# EasyEDA Pro project ProProject_NAFA AstrAlim_2024-01-08.epro, board AstrAlim PCB
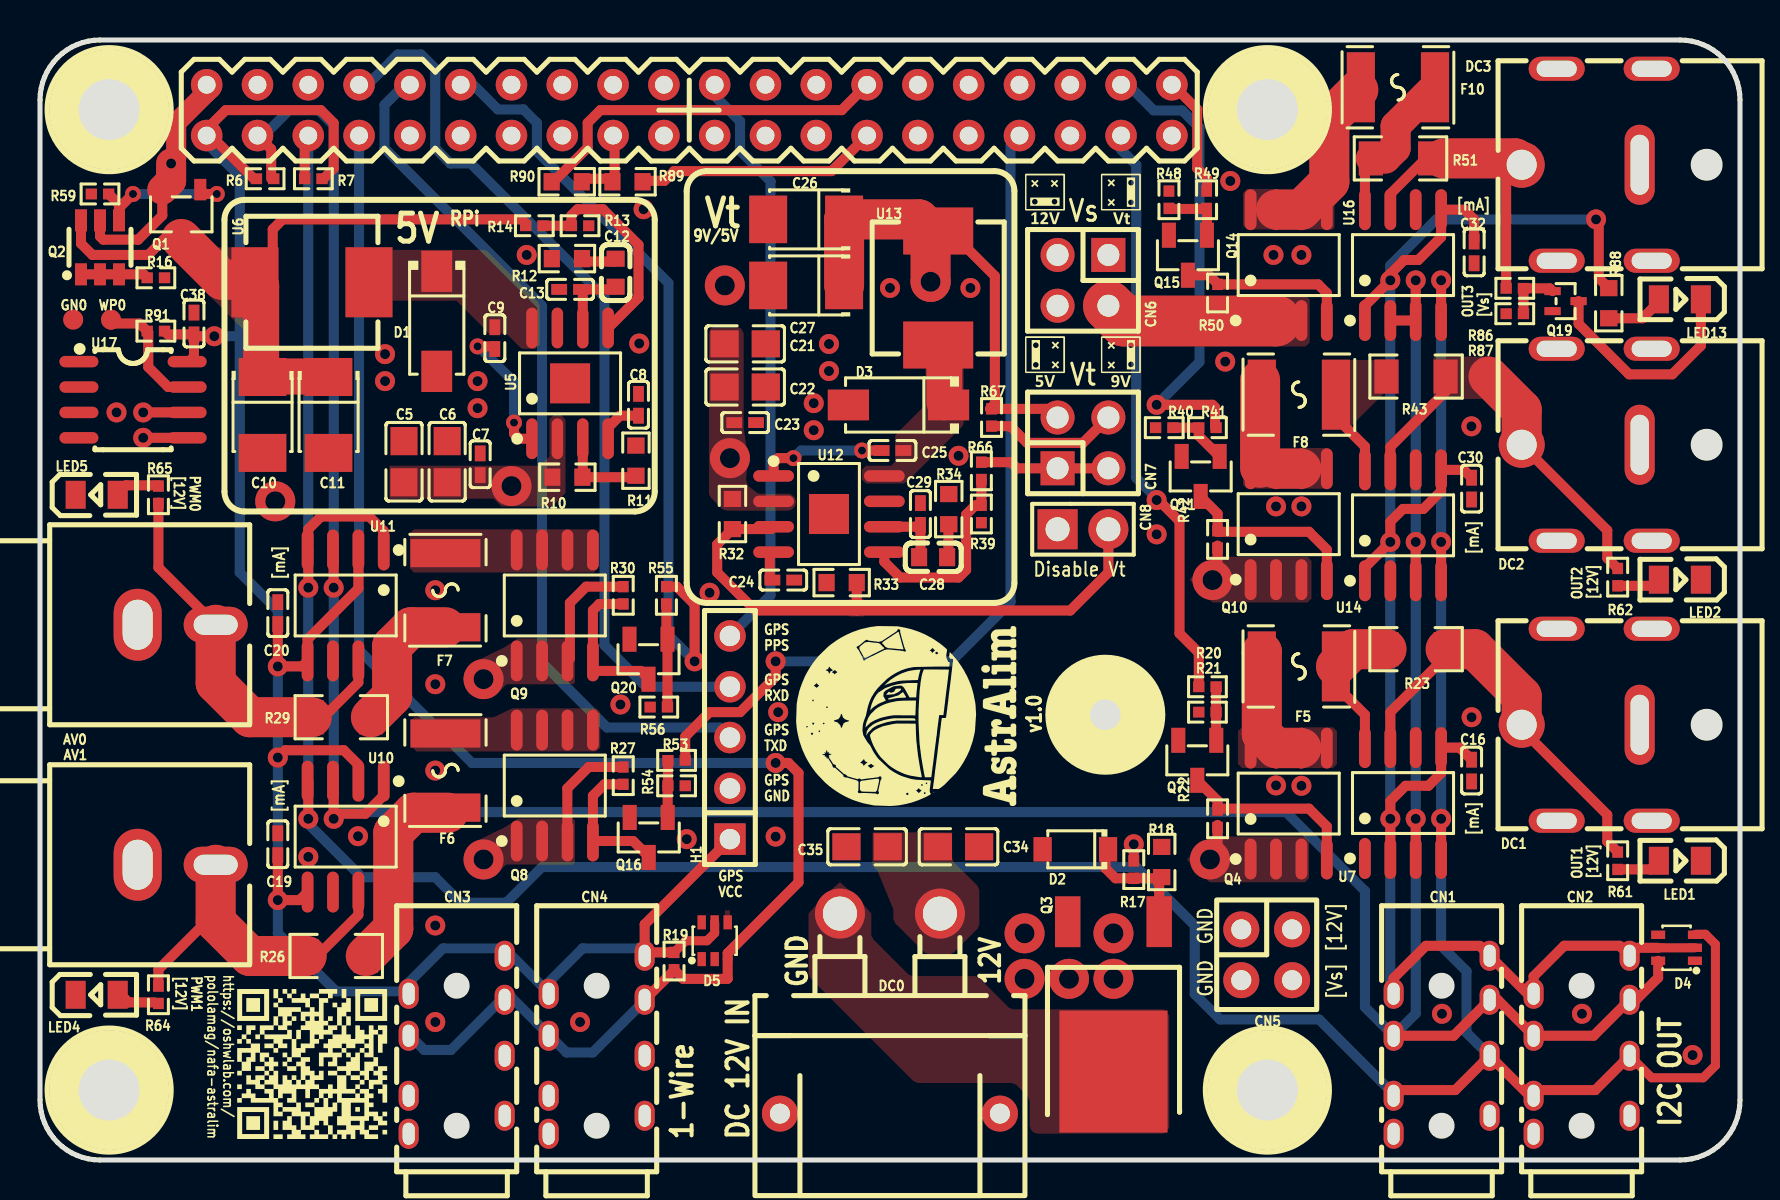
[diagram p2: board, top side]
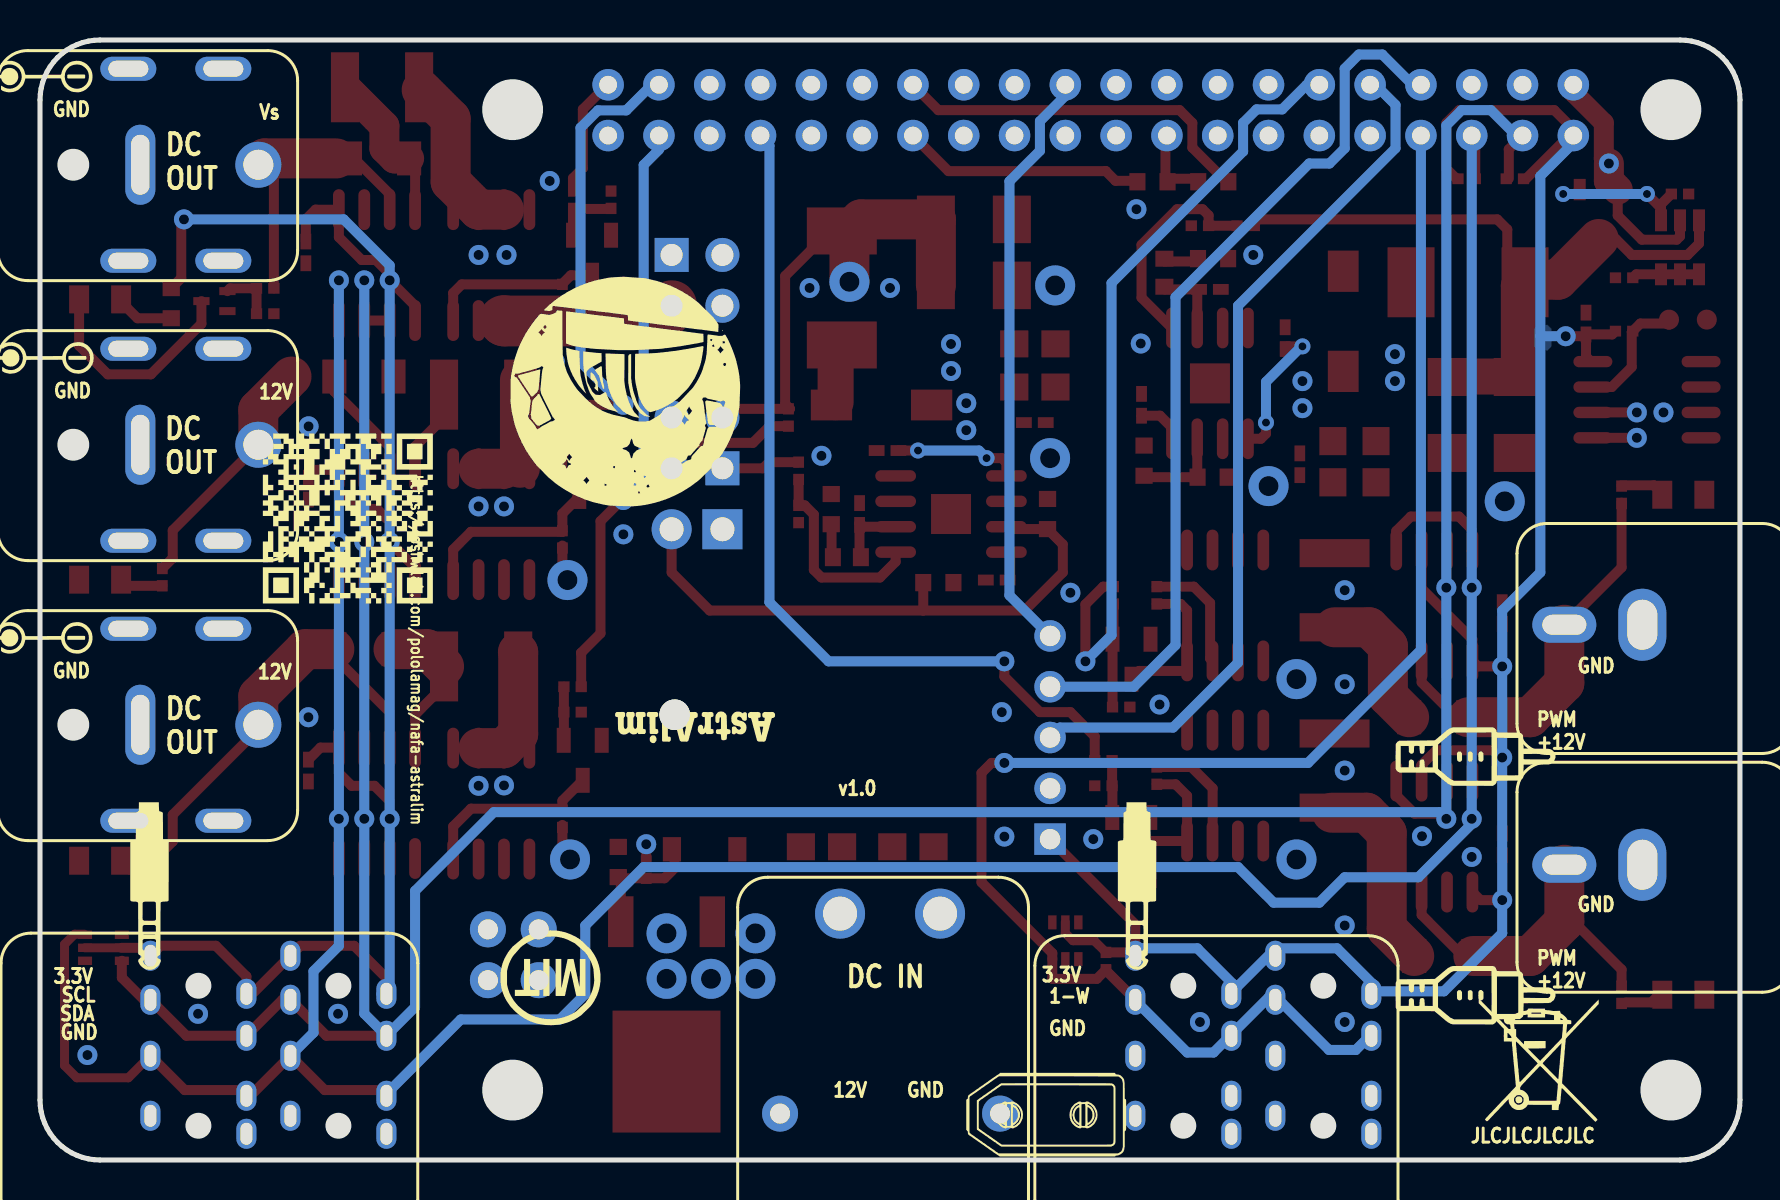
[diagram p3: board, bottom side, seen from below]

Outline 85 x 56 mm; copper layers: Top Layer, Inner1, Inner2, Bottom Layer. Coordinates in mm from the lower left corner of the outline.
Stack: Top Layer 0.035mm 外层铜厚1oz / Dielectric1 0.2104mm 7628 RC49% 8.6mil / Inner1 0.0152mm 内层铜厚 / Dielectric2 1.065mm 1.1mm H/HOZ 含铜 / Inner2 0.0152mm 内层铜厚 / Dielectric3 0.2104mm 7628 RC49% 8.6mil / Bottom Layer 0.035mm 外层铜厚1oz

## Design rules (mm)
template: Custom Config
spacing copperThickness1oz (default): track to track 0.102, other pairs 0.152 to 0.3
spacing copperThickness2oz: track to track 0.203, other pairs 0.152 to 0.3
spacing safeClearance1: track to track 0.152, other pairs 0.152 to 0.3
track width copperThickness1oz (default): min 0.3, default 0.5, max 6
track width copperThickness2oz: min 0.203, default 0.254, max 2.54
differential pair differentialPair (default): width min 0.127, default 0.254, max 2.54; gap min 0.152, default 0.152
via viaSize (default): diameter min 0.5, default 0.61, max 10; hole min 0.3, default 0.305, max 6.299

## Placement (name value [footprint] x y rotation side)
AV0  AV-5  [CONN-TH_AV-5]  6.83 26.76 270 top
AV1  AV-5  [CONN-TH_AV-5]  6.83 14.76 270 top
C5  4.7uF  [C0805]  18.2 34.91 270 top
C6  4.7uF  [C0805]  20.36 34.91 270 top
C7  10nF  [C0402]  22.01 34.79 270 top
C8  10nF  [C0402]  29.92 37.76 270 top
C9  10nF  [C0402]  22.74 41.09 90 top
C10  47uF  [CAP-SMD_L3.5-W2.8-R-RD]  11.13 37.25 90 top
C11  47uF  [CAP-SMD_L3.5-W2.8-R-RD]  14.43 37.25 90 top
C12  2.2nF  [C0603]  28.78 44.36 270 top
C13  22pF  [C0402]  26.5 43.53 0 top
C16  100nF  [C0402]  71.58 19.47 270 top
C19  100nF  [C0402]  11.89 15.79 90 top
C20  100nF  [C0402]  11.89 27.35 90 top
C21  4.7uF  [C0805]  35.26 40.81 180 top
C22  4.7uF  [C0805]  35.26 38.65 180 top
C23  10nF  [C0402]  35.26 36.87 180 top
C24  10nF  [C0402]  37.16 29 180 top
C25  10nF  [C0402]  42.62 35.47 0 top
C26  47uF  [CAP-SMD_L3.5-W2.8-R-RD]  38.31 47.03 0 top
C27  47uF  [CAP-SMD_L3.5-W2.8-R-RD]  38.31 43.73 0 top
C28  2.2nF  [C0603]  44.66 30.14 180 top
C29  22pF  [C0402]  44.02 32.3 270 top
C30  100nF  [C0402]  71.58 33.57 270 top
C32  100nF  [C0402]  71.71 45.38 270 top
C34  22uF  [C0805]  45.93 15.66 180 top
C35  22uF  [C0805]  41.35 15.66 0 top
C38  100nF  [C0402]  7.7 41.82 270 top
CN1  PJ-35372  [AUDIO-TH_PJ-35372]  70.08 5.76 180 top
CN2  PJ-35372  [AUDIO-TH_PJ-35372]  77.08 5.76 180 top
CN3  PJ-35372  [AUDIO-TH_PJ-35372]  20.83 5.76 180 top
CN4  PJ-35372  [AUDIO-TH_PJ-35372]  27.83 5.76 180 top
CN5  2.54-2*2  [HDR-TH_4P-P2.54-V-F-R2-C2-S2.54]  61.33 10.26 270 top
CN6  PH-00068  [HDR-TH_4P-P2.54-V-M-R2-C2-S2.54]  52.15 43.98 180 top
CN7  PH-00068  [HDR-TH_4P-P2.54-V-M-R2-C2-S2.54]  52.15 35.86 0 top
CN8  PZ254V-11-02P  [HDR-TH_2P-P2.54-V-M]  52.15 31.54 0 top
D1  SS54  [SMA_L4.4-W2.8-LS5.4-R-RD]  19.84 41.94 270 top
D2  MM1Z15  [SOD-123_L2.7-W1.6-LS3.7-RD]  51.77 15.53 180 top
D3  SS54  [SMA_L4.4-W2.8-LS5.4-R-RD]  42.92 37.75 180 top
D4  BAV99S,115  [SOT-363_L2.0-W1.3-P0.65-LS2.1-TL]  81.83 10.61 180 top
D5  BAV99S,115  [SOT-363_L2.0-W1.3-P0.65-LS2.1-TL]  33.73 10.96 90 top
DC0  XT30PW-M  [CONN-TH_XT30PW-F-1]  42.5 9.82 0 top
DC1  DC-053D-25A  [DC-IN-TH_DC-053D-25A-1]  77.33 21.76 270 top
DC2  DC-053D-25A  [DC-IN-TH_DC-053D-25A-1]  77.33 35.76 270 top
DC3  DC-053D-25A  [DC-IN-TH_DC-053D-25A-1]  77.33 49.76 270 top
F5  SMD1812P300SLR/24  [F1812]  62.94 24.68 180 top
F6  SMD1812P300SLR/24  [F1812]  20.27 19.47 90 top
F7  SMD1812P300SLR/24  [F1812]  20.27 28.49 90 top
F8  SMD1812P300SLR/24  [F1812]  62.94 38.27 180 top
F10  SMD1812P300SLR/24  [F1812]  67.9 53.64 180 top
GN0  -  [test-point-0.5mm]  1.66 42.02 180 top
H1  2.54-1*5P  [HDR-TH_5P-P2.54-V-F]  34.5 21.12 90 top
LED1  NCD0805R1  [LED0805-R-RD]  81.99 14.96 180 top
LED2  NCD0805R1  [LED0805-R-RD]  81.99 29.02 180 top
LED4  NCD0805R1  [LED0805-R-RD]  2.83 8.26 0 top
LED5  NCD0805R1  [LED0805-R-RD]  2.83 33.26 0 top
LED13  NCD0805R1  [LED0805-R-RD]  81.99 43.03 180 top
NOREF  -  [Pad_e599]  53.27 22.26 180 top
Q1  DMMT5401-7-F  [SOT-23-6_L2.9-W1.6-P0.95-LS2.8-BR]  3 45.63 270 top
Q2  AP2317A  [SOT-23-3_L2.9-W1.6-P1.90-LS2.8-BR]  7.06 47.28 90 top
Q3  IRFR1205TRPBF  [TO-252-3_L6.5-W5.8-P4.58-BL]  53.67 8.17 180 top
Q4  NCE30P12S  [SOIC-8_L4.9-W3.9-P1.27-LS6.0-BL]  62.44 17.82 0 top
Q7  MMBT3904  [SOT-23-3_L2.9-W1.3-P1.90-LS2.4-BR]  57.87 19.98 90 top
Q8  NCE30P12S  [SOIC-8_L4.9-W3.9-P1.27-LS6.0-BL]  25.74 18.72 0 top
Q9  NCE30P12S  [SOIC-8_L4.9-W3.9-P1.27-LS6.0-BL]  25.74 27.73 0 top
Q10  NCE30P12S  [SOIC-8_L4.9-W3.9-P1.27-LS6.0-BL]  62.44 31.79 0 top
Q11  MMBT3904  [SOT-23-3_L2.9-W1.3-P1.90-LS2.4-BR]  58.03 34.18 90 top
Q14  NCE30P12S  [SOIC-8_L4.9-W3.9-P1.27-LS6.0-BL]  62.44 44.75 0 top
Q15  MMBT3904  [SOT-23-3_L2.9-W1.3-P1.90-LS2.4-BR]  57.4 45.24 90 top
Q16  MMBT3904  [SOT-23-3_L2.9-W1.3-P1.90-LS2.4-BR]  30.44 16.13 90 top
Q19  MMBT3904TT1G  [SC-75-3_L1.6-W0.8-P1.00-LS1.6-BR]  76.28 42.94 180 top
Q20  MMBT3904  [SOT-23-3_L2.9-W1.3-P1.90-LS2.4-BR]  30.43 25.04 90 top
R6  10kΩ  [R0402]  11.26 49.06 180 top
R7  10kΩ  [R0402]  13.67 49.06 0 top
R10  665kΩ  [R0603]  26.37 34.14 180 top
R11  130kΩ  [R0603]  29.8 34.97 270 top
R12  39kΩ  [R0603]  26.35 45.07 180 top
R13  1.96kΩ  [R0402]  27 46.71 180 top
R14  10.2kΩ  [R0402]  24.72 46.71 180 top
R16  10kΩ  [R0402]  5.79 44.11 180 top
R17  1kΩ  [R0402]  54.69 14.52 270 top
R18  470kΩ  [R0603]  56.09 14.9 270 top
R19  4.7kΩ  [R0402]  31.7 9.95 90 top
R20  10kΩ  [R0402]  58.37 22.39 0 top
R21  1kΩ  [R0402]  58.37 23.66 0 top
R22  1kΩ  [R0402]  58.88 17.06 270 top
R23  10mΩ  [R1206]  68.8 25.54 180 top
R26  10mΩ  [R1206]  14.81 10.2 0 top
R27  1kΩ  [R0402]  29.16 19.22 90 top
R29  10mΩ  [R1206]  15.06 22.14 0 top
R30  1kΩ  [R0402]  29.16 28.23 90 top
R32  665kΩ  [R0603]  34.62 32.3 90 top
R33  82kΩ  [R0603]  40.08 28.87 0 top
R34  39kΩ  [R0603]  45.44 32.54 90 top
R39  1.96kΩ  [R0402]  47.07 32.3 90 top
R40  10kΩ  [R0402]  56.21 36.62 0 top
R41  1kΩ  [R0402]  58.37 36.62 180 top
R42  1kΩ  [R0402]  58.88 31.03 270 top
R43  10mΩ  [R1206]  68.8 39.17 180 top
R48  10kΩ  [R0402]  56.45 48.01 270 top
R49  1kΩ  [R0402]  58.33 48.01 270 top
R50  1kΩ  [R0402]  58.88 43.35 270 top
R51  10mΩ  [R1206]  68.02 50.08 180 top
R53  1kΩ  [R0402]  31.83 19.98 180 top
R54  10kΩ  [R0402]  31.83 18.71 180 top
R55  1kΩ  [R0402]  31.32 28.23 270 top
R56  10kΩ  [R0402]  30.94 22.65 0 top
R59  47kΩ  [R0402]  3 48.3 0 top
R61  470Ω  [R0402]  78.88 14.96 270 top
R62  470Ω  [R0402]  78.88 29.14 270 top
R64  470Ω  [R0402]  5.92 8.26 270 top
R65  470Ω  [R0402]  5.92 33.26 90 top
R66  10.2kΩ  [R0402]  47.07 34.46 90 top
R67  10kΩ  [R0402]  47.58 37.12 90 top
R86  10kΩ  [R0402]  73.74 43.58 180 top
R87  10kΩ  [R0402]  73.74 42.31 0 top
R88  68Ω  [R0603]  78.44 42.84 270 top
R89  3.9kΩ  [R0603]  29.38 48.91 180 top
R90  3.9kΩ  [R0603]  26.34 48.91 0 top
R91  1kΩ  [R0402]  5.79 41.44 0 top
U0  RASPI HAT FULL  [RASBERRYPI-3-HAT-EXT]  8.33 53.76 0 top
U5  TPS54531DDAR  [SOIC-8_L5.0-W4.0-P1.27-LS6.0-BL-EP2.0]  26.5 38.83 0 top
U6  4.7uH  [IND-SMD_L7.2-W6.6_GPSR07X0]  13.6 43.89 180 top
U7  INA219AIDR  [SOIC-8_L4.9-W3.9-P1.27-LS6.0-BL]  68.15 17.85 0 top
U10  INA219AIDR  [SOIC-8_L4.9-W3.9-P1.27-LS6.0-BL]  15.28 16.17 180 top
U11  INA219AIDR  [SOIC-8_L4.9-W3.9-P1.27-LS6.0-BL]  15.28 27.73 180 top
U12  TPS54531DDAR  [SOIC-8_L5.0-W4.0-P1.27-LS6.0-BL-EP2.0]  39.45 32.3 270 top
U13  4.7uH  [IND-SMD_L7.2-W6.6_GPSR07X0]  44.91 43.6 90 top
U14  INA219AIDR  [SOIC-8_L4.9-W3.9-P1.27-LS6.0-BL]  68.15 31.73 0 top
U16  INA219AIDR  [SOIC-8_L4.9-W3.9-P1.27-LS6.0-BL]  68.15 44.75 0 top
U17  CAT24C32WI-GT3  [SOIC-8_L5.0-W4.0-P1.27-LS6.0-BL]  4.65 38.01 270 top
WP0  -  [test-point-0.5mm]  3.55 42.02 180 top

## Footprints (pads in the part's own frame, mm; a bottom-side part is the same pattern mirrored in y, then rotated)
AUDIO-TH_PJ-35372
  oval 1x1.5 hole 0.6x1.1: 1(-2.4,3.55) 2(-2.4,0.55) 3(-2.4,-2.25) 4(-2.4,-4.45) 5(2.4,4.45) 6(2.4,2.55) 7(2.4,-0.45) 8(2.4,-2.55)
C0402
  rect 0.79x0.54 smd: 1(-0.545,0) 2(0.545,0)
C0603
  rect 0.8x0.9 smd: 1(-0.7,0) 2(0.7,0)
C0805
  rect 1.41x1.35 smd: 1(-1.03,0) 2(1.03,0)
CAP-SMD_L3.5-W2.8-R-RD
  rect 1.9x2.376 smd: 1(1.899,0) 2(-1.899,0)
CONN-TH_AV-5
  oval 3.6x2.4 hole 2.5x1.5: 1(0,-1.95)
  oval 1.8x3.2 hole 1x2.2: 2(0,1.95)
CONN-TH_XT30PW-F-1
  round 2.5 hole 1.7: 1(-2.5,2.5) 2(2.5,2.5)
  round 1.8 hole 1: 3(5.5,-7.5) 4(-5.5,-7.5)
DC-IN-TH_DC-053D-25A-1
  round 2.3 hole 1.5: 1(0,-3.25)
  oval 4x1.5 hole 3x0.914: 2(0,2.65)
  oval 1.2x2.8 hole 0.8x2: 3(-4.8,3.25) 3(-4.8,-1.5) 3(4.8,3.25) 3(4.8,-1.5)
F1812
  rect 1.407x3.499 smd: 1(-1.853,0) 2(1.853,0)
HDR-TH_2P-P2.54-V-M
  rect 2x2 hole 1.2: 1(-1.27,0)
  round 2 hole 1.2: 2(1.27,0)
HDR-TH_4P-P2.54-V-F-R2-C2-S2.54
  round 1.8 hole 1: 1(-1.27,-1.27) 2(-1.27,1.27) 3(1.27,-1.27) 4(1.27,1.27)
HDR-TH_4P-P2.54-V-M-R2-C2-S2.54
  rect 1.7x1.7 hole 1.1: 1(-1.27,-1.27)
  round 1.7 hole 1.1: 2(-1.27,1.27) 3(1.27,-1.27) 4(1.27,1.27)
HDR-TH_5P-P2.54-V-F
  rect 1.575x1.575 hole 1.02: 1(-5.08,0)
  round 1.575 hole 1.02: 2(-2.54,0) 3(0,0) 4(2.54,0) 5(5.08,0)
IND-SMD_L7.2-W6.6_GPSR07X0
  rect 2.35x3.5 smd: 1(-2.85,0) 2(2.85,0)
LED0805-R-RD
  rect 1x1.399 smd: 1(1.05,0) 2(-1.05,0)
Pad_e599
  round 1.524 hole 3: 41(0,0)
R0402
  rect 0.566x0.54 smd: 1(-0.433,0) 2(0.433,0)
R0603
  rect 0.806x0.864 smd: 1(-0.753,0) 2(0.753,0)
R1206
  rect 1.208x1.701 smd: 1(-1.479,0) 2(1.479,0)
RASBERRYPI-3-HAT-EXT
  round 1.575 hole 0.889: 1(0,-2.54) 2(0,0) 3(2.54,-2.54) 4(2.54,0) 5(5.08,-2.54) 6(5.08,0) 7(7.62,-2.54) 8(7.62,0) 9(10.16,-2.54) 10(10.16,0) 11(12.7,-2.54) 12(12.7,0) 13(15.24,-2.54) 14(15.24,0) 15(17.78,-2.54) 16(17.78,0) 17(20.32,-2.54) 18(20.32,0) 19(22.86,-2.54) 20(22.86,0) 21(25.4,-2.54) 22(25.4,0) 23(27.94,-2.54) 24(27.94,0) 25(30.48,-2.54) 26(30.48,0) 27(33.02,-2.54) 28(33.02,0) 29(35.56,-2.54) 30(35.56,0) 31(38.1,-2.54) 32(38.1,0) 33(40.64,-2.54) 34(40.64,0) 35(43.18,-2.54) 36(43.18,0) 37(45.72,-2.54) 38(45.72,0) 39(48.26,-2.54) 40(48.26,0)
SC-75-3_L1.6-W0.8-P1.00-LS1.6-BR
  rect 0.816x0.4 smd: 1(0.65,-0.5) 2(0.65,0.5) 3(-0.65,0)
SMA_L4.4-W2.8-LS5.4-R-RD
  rect 2.062x1.539 smd: 1(2.503,0) 2(-2.503,0)
SOD-123_L2.7-W1.6-LS3.7-RD
  rect 0.91x1.22 smd: 1(-1.635,0) 2(1.635,0)
SOIC-8_L4.9-W3.9-P1.27-LS6.0-BL
  oval 0.588x2.045 smd: 1(-1.905,-2.772) 2(-0.635,-2.772) 3(0.635,-2.772) 4(1.905,-2.772) 5(1.905,2.772) 6(0.635,2.772) 7(-0.635,2.772) 8(-1.905,2.772)
SOIC-8_L5.0-W4.0-P1.27-LS6.0-BL
  oval 0.569x1.95 smd: 1(-1.905,-2.705) 2(-0.635,-2.705) 3(0.635,-2.705) 4(1.905,-2.705) 5(1.905,2.705) 6(0.635,2.705) 7(-0.635,2.705) 8(-1.905,2.705)
SOIC-8_L5.0-W4.0-P1.27-LS6.0-BL-EP2.0
  oval 0.574x2.038 smd: 1(-1.905,-2.769) 2(-0.635,-2.769) 3(0.635,-2.769) 4(1.905,-2.769) 5(1.905,2.769) 6(0.635,2.769) 7(-0.635,2.769) 8(-1.905,2.769)
  rect 2x2 smd: 9(0,0)
SOT-23-3_L2.9-W1.3-P1.90-LS2.4-BR
  rect 1.25x0.7 smd: 1(1,-0.95) 2(1,0.95) 3(-1,0)
SOT-23-3_L2.9-W1.6-P1.90-LS2.8-BR
  rect 1.07x0.6 smd: 1(1.235,-0.95) 2(1.235,0.95) 3(-1.235,0)
SOT-23-6_L2.9-W1.6-P0.95-LS2.8-BR
  rect 1.1x0.6 smd: 1(1.35,-0.95) 2(1.35,0) 3(1.35,0.95) 4(-1.35,0.95) 5(-1.35,0) 6(-1.35,-0.95)
SOT-363_L2.0-W1.3-P0.65-LS2.1-TL
  rect 0.7x0.42 smd: 1(-0.92,0.65) 2(-0.92,0) 3(-0.92,-0.65) 4(0.92,-0.65) 5(0.92,0) 6(0.92,0.65)
test-point-0.5mm
  round 1 smd: 1(0,0)
TO-252-3_L6.5-W5.8-P4.58-BL
  rect 1.27x2.54 smd: 1(-2.288,-3.747) 3(2.288,-3.745)
  rect 5.4x6.1 smd: 2(-0.002,3.747)

## Nets
As in the schematic, except:
GND: AV0.1 AV1.1 C5.1 C6.1 C7.1 C8.1 C10.2 C11.2 C13.1 C16.2 C19.2 C20.2 C21.1 C22.1 C23.1 C24.1 C26.2 C27.2 C29.1 C30.2 C32.2 C34.1 C35.1 C38.1 CN1.1 CN1.5 CN2.1 CN2.5 CN3.1 CN3.5 CN4.1 CN4.5 CN5.1 CN5.3 CN8.1 D1.1 D2.2 D3.1 D4.1 D4.4 D5.4 DC1.2 DC1.3 DC2.2 DC2.3 DC3.2 DC3.3 GN0.1 H1.2 LED1.2 LED2.2 LED4.2 LED5.2 NOREF.41 Q3.3 Q7.2 Q11.2 Q15.2 Q16.2 Q19.2 Q20.2 R11.1 R12.2 R13.1 R16.1 R18.1 R20.1 R33.1 R34.2 R39.1 R40.1 R48.1 R54.1 R56.1 R59.1 R87.1 U0.6 U0.9 U0.14 U0.20 U0.25 U0.30 U0.34 U0.39 U5.7 U5.9 U7.1 U7.6 U10.6 U11.6 U12.7 U12.9 U14.2 U14.6 U16.6 U17.3 U17.4
1-WIRE: CN3.3 CN3.7 CN4.3 CN4.7 D5.3 R19.1 U0.7

Pads without a net: CN3 2 6; CN4 2 6; CN6 3; D5 1 2 6; DC0 3 4; U0 11 13 15 16 18 19 21 23 24 26 29 31 32 35 36; U17 1 2

## Via types
v1: diameter 1, hole 0.5, Top Layer to Bottom Layer, 69 vias
v2: diameter 2, hole 1, Top Layer to Bottom Layer, 14 vias
v3: diameter 0.8, hole 0.4, Top Layer to Bottom Layer, 6 vias

## Routing (per net, layer and track width the routed paths; a pad name or vN(x,y) marks a point on that pad's centre or on a via; arc(x,y) is an arc through that point)
+3.3V: length 288.9
  Top Layer w0.45: R19.2 32.28,10.96 33.35,10.96 33.73,11.34 D5.5 ; D4.5 D4.2
  Top Layer w0.5: C30.1 71.19,34.51 U14.5 70.06,33.44 69.17,32.55 68.15,32.55 67.52,31.92 v1(67.52,30.9) 66.25,29.63 U14.1 ; 30.4,10.38 CN4.4 30.23,11.78 H1.1 ; 30.4,10.38 30.28,10.38 ; 30.4,10.38 R19.2 ; 10.7,49.06 8.54,51.22 U0.1 8.33,51.54 9.28,52.49 14.04,52.49 14.68,51.85 14.68,49.57 14.18,49.06 R7.2 ; R88.1 77.94,44.09 77.94,46.9 v1(77.8,47.03) ; U0.17 28.73,51.15 28.73,49.06 27.44,49.06 ; CN1.8 67.68,9.09 69.29,10.71 71.98,10.71 CN1.4 74.38,8.31 CN2.8 74.68,9.18 76.21,10.71 78.98,10.71 CN2.4 79.88,10.61 D4.5 ; U10.5 12.98,13 v1(11.89,13) C19.1 ; C38.2 7.7,40.17 7.45,39.92 7.1,39.92 ; C38.2 6.39,41.28 R91.2 ; C38.2 7.79,41.19 v1(8.72,41.19) ; C16.1 70.98,20.62 U7.5 70.06,19.34 69.42,18.71 68.28,18.71 67.52,17.95 v1(67.52,17.06) U7.2 ; v1(11.89,20.12) 12.25,20.49 15.19,20.49 15.92,19.76 U10.2 ; 11.89,26.8 v1(11.89,24.68) 13.1,24.68 U11.5 13.38,26.03 15.92,28.57 15.92,30.5 ; U16.1 66.25,42.71 v1(67.52,43.98) 67.52,44.31 68.21,45 68.91,45 70.06,46.14 U16.5 71.22,47.52 71.71,47.03 C32.1
  Inner2 w0.5: v1(67.52,43.98) 64.34,47.16 59.1,47.16 57.86,48.4 57.86,54.27 57.1,55.03 30.71,55.03 29.99,54.31 29.99,53.09 28.65,51.76 28.65,51.4 ; 28.65,51.4 U0.17 ; 28.65,51.4 27.56,52.49 10.05,52.49 8.78,51.22 U0.1
  Bottom Layer w0.5: v1(77.8,47.03) 69.81,47.03 67.52,44.73 v1(67.52,43.98) v1(67.52,30.9) v1(67.52,17.06) 67.52,8.73 67.93,8.31 ; 9.98,41.21 9.97,41.19 v1(8.72,41.19) ; 9.98,41.21 9.98,29.38 11.89,27.47 v1(11.89,24.68) v1(11.89,20.12) v1(11.89,13) 11.89,11.34 14.8,8.43 18.38,8.43 18.38,8.82 20.15,10.58 23.22,10.58 25.17,8.62 27.13,10.58 29.92,10.58 30.16,10.33 ; 9.98,41.21 9.98,49.19 8.33,50.84 U0.1
+5V_A: length 34.4
  Top Layer w0.5: R14.2 24.28,46.84 24.09,47.03 12.14,47.03 11.64,46.53 11.64,44.9 10.75,44.01 ; Q2.3 6.21,46.05 5.41,45.25 2.62,45.25 2.05,45.82 Q1.6
  Top Layer w1.8: 10.75,44.01 11.06,43.7 11.06,39.2 11.09,39.17 13.34,39.17
  Top Layer w2: 10.75,44.01 9.1,44.01 Q2.3
+5V_PI: length 19.2
  Top Layer w0.5: Q1.5 3,46.18 3.17,46.02 4.91,46.02 6.11,47.22 Q2.2
  Top Layer w1: U0.2 8.33,53.38 6.81,51.86 6.81,50.08 v1(6.56,49.83)
  Top Layer w1.5: Q2.2 6.56,48.96 v1(6.56,49.83)
  Inner2 w1.5: v1(6.56,49.83) 6.56,51.98 U0.2 U0.4
+9V: length 38.7
  Top Layer w0.5: CN7.2 50.45,37.56 47.5,37.56 47.74,37.8 47.74,44.2 45.49,46.45 44.53,46.45
  Top Layer w2: C27.1 C26.1 43.95,47.03 44.53,46.45 v2(44.53,43.91)
  Inner2 w2.2: v2(44.53,43.91) 44.53,46.4 46.18,48.05 51.77,48.05 53.42,46.4 CN6.1
+12V: length 42.8
  Top Layer w0.5: 29.16,19.65 27.44,19.65 26.37,18.58 26.37,15.96 Q8.3 ; 58.88,30.72 58.88,29.25 v2(58.63,29) ; v1(54.69,15.79) R17.1 ; R30.2 27.31,28.67 26.5,27.85 26.5,25.07 Q9.3 ; 58.88,16.75 58.88,15.41 v2(58.5,15.03)
  Inner2 w2: CN5.2 62.6,13.59 61.17,15.03 v2(58.5,15.03)
  Inner2 w2.2: v2(58.63,29) 58.63,37.72 56.43,39.92 51.68,39.92 50.88,40.72 CN6.4
  vias: v2(22.18,24.04) v2(22.18,15.03) v2(23.57,33.7) v2(34.5,35.09)
GND:
  vias: v1(3.83,37.38) v1(13.41,15.15) v1(15.9,16.19) v1(17.25,40.29) v1(17.25,38.94) v1(19.76,28.49) v1(19.76,23.79) v1(19.76,19.47) v1(19.76,11.72) v1(19.76,6.9) v1(21.88,38.94) v1(21.88,37.59) v1(24.34,45.25) v1(27,6.9) v1(29.02,22.77) v1(29.96,40.82) v1(30.18,47.54) v1(32.34,16.04) v1(33.48,28.36) v1(36.78,16.17) v1(36.91,22.39) v1(38.69,37.84) v1(38.69,36.49) v1(39.45,40.8) v1(39.45,39.45) v1(42.5,43.6) v1(45.93,35.21) v1(46.52,43.6) v1(55.83,31.28) v1(59.26,39.92) v1(59.52,48.95) v1(61.67,45.25) v1(61.8,32.68) v1(61.8,18.73) v1(63.07,45.25) v1(63.07,32.68) v1(63.07,18.71) v1(70.1,7.31) v1(71.57,36.68) v1(71.58,22.14) v1(77.1,7.31) v1(82.63,5.25) v2(11.76,32.93) v2(34.24,43.73) v2(49.23,11.33) v2(49.23,9.06) v2(51.45,9.06) v2(53.67,11.33) v2(53.67,9.06)
1-WIRE: length 82.6
  Top Layer w0.5: CN4.3 31.7,9.48 R19.1 32.16,9.06 34.37,9.06 34.38,9.07 D5.3 34.38,10.34 37.93,13.88 37.93,19.35 37.43,19.85 v1(36.78,19.85)
  Bottom Layer w0.5: v1(36.78,19.85) 21.6,19.85 15.95,25.5 U0.7 ; 30.16,8.13 30.16,7.9 27.64,5.38 26.32,5.38 23.56,8.13 23.18,8.13 20.55,5.5 19.21,5.5 18.38,6.33
GPIO13_PWM1: length 44.2
  Top Layer w0.5: R53.1 32.26,21.17 33.48,22.39 35,22.39 36.78,24.17 v1(36.78,24.93)
  Bottom Layer w0.5: 48.99,51.18 48.53,50.72 48.53,27.89 45.57,24.93 v1(36.78,24.93)
GPIO18_PWM0: length 39.4
  Top Layer w0.5: R55.1 31.84,28.67 32.73,27.78 v1(32.73,24.93)
  Bottom Layer w0.5: U0.12 21.66,53.76 22.89,52.53 24.17,52.53 24.84,51.86 24.84,50.43 31.42,43.85 31.42,26.24 v1(32.73,24.93)
GPIO20: length 23.5
  Top Layer w0.5: R41.1 58.75,36.67 58.75,37.63 58.63,37.76 v1(55.83,37.76)
  Bottom Layer w0.5: v1(55.83,37.76) 57.97,39.9 57.97,51.61 57.1,52.48 55.69,52.48 54.49,53.68 54.08,53.68
GPIO21: length 6
  Top Layer w0.5: 58.35,48.46 58.35,49.09 57.86,49.58 57.86,52.54 56.65,53.74
GPIO26: length 29.2
  Top Layer w0.5: 57.94,23.66 57.94,25.35 57.95,25.36 56.97,26.33 56.97,31.94 55.92,33
  Bottom Layer w0.5: U0.37 54.05,50.52 54.82,49.75 54.82,34.1 55.92,33
  vias: v1(55.83,33)
ID_SC: length 68.3
  Top Layer w0.5: 25.59,49.01 25.78,49.01 27.38,50.62 27.38,51.86 28.02,52.49 40.08,52.49 U0.28 ; v1(5.16,37.38) 7.1,37.38
  Inner2 w0.5: U0.28 41.02,53.76 40.08,52.82 40.08,50.21 36.27,46.4 11.64,46.4 10.75,45.51 10.75,39.79 9.48,38.52 6.3,38.52 v1(5.16,37.38)
ID_SD: length 61.8
  Top Layer w0.5: 31.71,49.44 31.71,49.45 ; 31.71,49.44 31.23,48.96 30.19,48.96 ; 31.71,49.44 39.58,49.44 U0.27 ; v1(5.16,36.11) 7.1,36.11
  Inner2 w0.5: v1(5.16,36.11) 11.26,36.11 13.16,38.01 13.16,41.32 14.05,42.2 38.05,42.2 41.35,45.51 U0.27
PPS: length 29.6
  Bottom Layer w0.5: U0.22 33.73,53.21 35,51.94 35,50.46 36.53,48.94 36.53,28.23 H1.5
RXD: length 43.8
  Bottom Layer w0.5: U0.10 18.23,53.76 17.22,52.75 17.22,50.59 25.1,42.71 25.1,24.87 28.35,21.62 34,21.62 H1.3
SCL: length 182.6
  Top Layer w0.45: CN2.2 80.58,4.11 83.16,4.11 83.77,4.72 83.77,10.79 83.27,11.29 82.77,11.29
  Top Layer w0.5: CN1.6 67.96,3.5 70.76,3.5 CN1.2 74.48,3.21 CN2.6 74.96,3.5 77.76,3.5 CN2.2 ; 13.41,30.46 13.38,30.5 ; 13.41,30.46 13.41,31.54 14.05,32.17 16.46,32.17 17.19,31.45 17.19,30.5 ; 13.41,30.46 v1(13.41,28.62) ; v1(13.41,17.06) 13.41,18.91 U10.4 ; v1(70.06,43.98) U16.4 ; R7.1 13.23,51.04 U0.5 ; v1(70.06,30.9) U14.4 ; v1(70.06,17.06) U7.4
  Bottom Layer w0.5: v1(70.06,43.98) v1(70.06,30.9) v1(70.06,17.06) 70.06,10.71 71.33,9.44 71.33,6.37 CN1.2 ; 67.71,3.28 63.96,7.03 59.01,7.03 57.74,8.3 57.74,11.72 54.82,14.65 25.1,14.65 23.32,12.87 21.03,12.87 19.76,14.14 16.08,14.14 13.41,16.81 v1(13.41,17.06) v1(13.41,28.62) U0.5 ; CN1.6 67.52,3.21
SDA: length 172.4
  Top Layer w0.5: 72.73,8.01 72.88,8.01 CN2.7 77.68,6.21 CN2.3 79.81,8.01 80.91,9.11 D4.6 ; 11.56,49.06 11.56,50.53 U0.3 ; U16.2 U16.3 v1(68.79,43.98) ; 14.65,30.5 14.68,30.46 v1(14.68,28.62) ; U10.3 14.68,18.91 v1(14.68,17.06) 14.94,17.31 16.27,17.31 17.19,18.24 U10.1 ; CN1.7 70.68,6.21 CN1.3 ; v1(68.79,30.9) U14.3 ; v1(68.79,17.06) U7.3
  Bottom Layer w0.5: U0.3 11.19,51.22 12.46,52.49 13.92,52.49 14.68,51.73 v1(14.68,28.62) v1(14.68,17.06) 15.02,17.39 62.31,17.39 66.25,13.45 66.25,7.65 CN1.7 68.79,7.32 v1(68.79,17.06) v1(68.79,30.9) v1(68.79,43.98)
TXD: length 44.8
  Bottom Layer w0.5: 34.5,23.66 30.31,23.66 28.22,25.74 28.22,43.14 21.54,49.83 20.53,49.83 19.76,50.59 19.76,54.57 19.06,55.28 17.89,55.28 16.37,53.76 U0.8
VS: length 53.6
  Top Layer w2.54: CN6.2 54.18,41.95 61.78,41.95 Q14.2
  Inner2 w2.2: CN5.4 63.84,8.99 65.36,10.51 65.36,38.27 60.91,42.71 CN6.2
$1N4635: length 4.6
  Top Layer w0.5: U5.3 27.14,34.16 R10.1 29.72,34.14 R11.2
$1N4659: length 2.3
  Top Layer w0.5: U5.4 28.41,36.62 29,37.22 C8.2
$1N4694: length 7
  Top Layer w0.5: U5.1 23.95,36.06 23.7,36.32 v3(23.7,36.87) ; 21.92,40.68 22.61,40.68 C9.1
  Bottom Layer w0.5: 21.92,40.68 23.7,38.9 v3(23.7,36.87)
  vias: v3(21.88,40.68)
$1N5140: length 2
  Top Layer w0.5: 28.91,45.06 28.77,44.93 26.94,44.93
$1N5148: length 3.9
  Top Layer w0.5: 28.91,43.66 28.77,43.53 C13.2 27.14,43.44 U5.6
$1N5310: length 10.9
  Top Layer w0.5: R14.1 R13.2 26.57,47.23 26.88,47.54 28.15,47.54 29.92,45.76 29.92,43.12 U5.5
$1N7006: length 7.6
  Top Layer w0.5: Q1.4 3.95,47.6 ; 3.95,47.6 v3(4.65,48.3) ; 3.95,47.6 3.95,47.78 R59.2 ; v3(8.84,48.3) 8.23,48.3 Q2.1
  Bottom Layer w0.5: v3(8.84,48.3) v3(4.65,48.3)
$1N7063: length 3.4
  Top Layer w0.5: 5.36,44.11 5.19,44.28 Q1.3 Q1.2 Q1.1
$1N14594: length 1.5
  Top Layer w0.5: U12.4 36.49,30.2 36.49,29
$1N14595: length 6.3
  Top Layer w0.5: v3(37.67,35.09) 36.91,35.09 36.68,34.86 U12.1 ; v3(41.1,35.47) C25.1
  Bottom Layer w0.5: v3(37.67,35.09) 38.05,35.47 v3(41.1,35.47)
$1N14596: length 3.2
  Top Layer w1.8: 45.22,37.89 45.22,40.06 44.53,40.75
$1N14599: length 1.5
  Top Layer w0.5: C28.1 45.42,30.21 45.42,31.59
$1N14601: length 3.4
  Top Layer w0.5: U12.6 43.83,31.66 44.02,31.86 44.02,30.44 43.96,30.37
$1N14603: length 10.1
  Top Layer w0.5: U12.5 42.22,29.91 43,29.12 45.93,29.12 46.31,29.5 46.31,32.27 46.77,32.73 R39.2 47.07,34.03
$1N50988: length 6.7
  Top Layer w0.5: R67.1 48.52,36.69 49.35,35.86 52.15,35.86 CN7.4
$1N55064: length 6.5
  Top Layer w0.5: R66.2 48.54,34.89 48.85,34.58 CN7.1 CN7.3
$1N55959: length 6
  Top Layer w0.5: Q3.1 55.96,11.92 55.96,14.09 R17.2 53.78,14.09 53.28,14.59 53.28,15.53
$1N59627: length 29.3
  Top Layer w0.5: U12.3 36.56,31.55 R32.1 33.86,30.78 33.86,29.38 35.77,27.47 40.84,27.47 ; 40.84,27.47 51.51,27.47 53.42,29.38 CN8.2 ; 40.84,27.47 R33.2
$1N62787: length 5.9
  Top Layer w0.5: 7.1,38.65 6.41,38.65 5.41,39.65 5.41,41.39 4.98,41.82 3.61,41.82 3.55,41.77
$2N529: length 2.7
  Top Layer w0.5: 58.81,20.98 58.81,20.99 R20.2 R21.2
$2N530: length 9.3
  Top Layer w0.5: 57.86,18.98 58.88,17.96 58.88,17.57 63.45,17.57 64.34,16.68 Q4.4
$2N536: length 7.5
  Top Layer w0.5: F5.1 64.8,23.71 66.25,22.27 U7.8
  Top Layer w2: F5.1 65.66,25.54 67.33,25.54
$2N538: length 6.4
  Top Layer w2: 61.1,25.4 61.09,25.38 61.09,21.3 Q4.7 Q4.6
$2N1597: length 7.1
  Top Layer w0.5: 30.43,15.17 29.65,15.95 Q8.4 27.65,18.21 28.22,18.78 R27.1
$2N1603: length 9.9
  Top Layer w2: 20.4,17.36 18.67,17.36 17.66,16.36 17.66,11.57 R26.2
$2N1610: length 7.6
  Top Layer w0.5: R30.1 27.97,27.8 27.65,27.48 Q9.4 27.65,24.54 27.74,24.45 30.04,24.45 30.43,24.06
$2N1616: length 7.1
  Top Layer w2: F7.1 18.55,26.64 17.61,25.7 17.61,23.2 R29.2
$2N3421: length 3.2
  Top Layer w0.5: 58.98,35.17 57.94,36.21 57.94,36.62 R40.2
$2N3422: length 9.4
  Top Layer w0.5: 58.03,33.17 58.88,32.32 58.88,31.41 63.45,31.41 64.34,30.52 Q10.4
$2N3428: length 4.4
  Top Layer w0.5: F8.1 64.8,37.12 66.25,35.68 U14.8
$2N3430: length 5.7
  Top Layer w2: 61,39 61,34.61 ; Q10.6 Q10.7
$2N4457: length 3.2
  Top Layer w0.5: 56.46,47.55 58.32,47.55 58.34,47.57 ; 58.35,46.25 58.35,47.59
$2N4458: length 8.7
  Top Layer w0.5: 57.4,44.24 58.45,44.24 58.91,43.78 ; Q14.4 64.34,43.35 63.91,43.78 R50.1
$2N4464: length 7.9
  Top Layer w0.5: U16.8 66.25,49.78 66.55,50.08
  Top Layer w1.5: 69.62,53.54 67.78,51.7 67.78,50.59 67.27,50.08 66.55,50.08
$2N4466: length 8.4
  Top Layer w2: Q14.7 Q14.6 64.47,48.91 64.47,52.06 65.92,53.51
$2N24815: length 2.8
  Top Layer w0.5: 31.38,17.17 31.38,18.7 R54.2 R53.2
$2N25317: length 5.2
  Top Layer w0.5: R55.2 31.32,26.12 31.38,26.06 31.37,26.05 R56.2
$2N39826: length 2
  Top Layer w0.5: 5.7,7.88 4.43,7.88 3.88,8.42
$2N39921: length 2.2
  Top Layer w0.5: 3.88,33.31 4.3,33.73 5.92,33.73
$2N39926: length 17.2
  Top Layer w0.5: U10.7 15.92,12.26 13.61,9.95 13.33,9.95 ; 5.92,8.97 5.92,9.52 8.31,11.91 8.78,11.91
  Top Layer w2: AV1.2 8.78,11.91 10.49,10.2 R26.1
$2N39937: length 19.8
  Top Layer w0.5: 5.92,32.87 5.92,29.62 AV0.2 ; U11.7 15.92,23.88 14.3,22.27 13.59,22.27
  Top Layer w2: AV0.2 8.78,23.85 10.49,22.14 R29.1
$2N40038: length 2.2
  Top Layer w0.5: R61.2 80.51,14.53 LED1.1
$2N40133: length 2.2
  Top Layer w0.5: R62.2 80.64,28.71 LED2.1
$2N40233: length 14.1
  Top Layer w0.5: R51.1 69.29,50.08 67.52,48.3 U16.7 ; R86.2 73.31,48.98 DC3.1 ; 74.01,49.83 74.08,49.91
  Top Layer w2: DC3.1 73.77,50.08 70.18,50.08
$2N40244: length 18.1
  Top Layer w0.5: DC2.1 78.36,31.48 78.36,30.1 R62.1 ; R43.1 70.28,38.42 67.52,35.66 U14.7
  Top Layer w2: DC2.1 74.08,37.51 72.43,39.17
$2N40255: length 20.6
  Top Layer w0.5: DC1.1 74.08,21.54 78.36,17.26 78.36,15.93 78.88,15.41 78.88,15.39 ; R23.1 70.28,25.16 67.52,22.39 U7.7
  Top Layer w2: R23.1 71.73,25.54 74.08,23.19 DC1.1
$2N49861: length 2.8
  Top Layer w0.5: Q19.1 75.49,43.58 R86.1 R87.2
$2N50059: length 11.1
  Top Layer w0.5: 83.04,42.91 83.04,40.72 81.61,39.28 79.45,39.28 76.93,41.81 Q19.3
$2N57491: length 2.8
  Top Layer w0.5: 80.94,42.91 80.13,42.09 R88.2

## Copper pours and planes (outline as drawn; the poured copper is in the pictures)
+3.3V on Bottom Layer: 9.42,41.76 10.29,41.76 10.29,40.47 9.42,40.47
+5V_A on Top Layer: 8.72,45.63 9.98,45.63 9.98,44.7 8.72,44.7
+5V_A on Top Layer: 8.33,43.7 11.45,43.7 11.45,41.25 8.33,41.25
+12V on Top Layer: 57.36,16.17 63.45,16.17 63.45,13.88 57.36,13.88
+12V on Top Layer: 17.48,37.31 26.28,37.31 26.28,32.68 17.48,32.68
+12V on Top Layer: 57.48,30.16 63.58,30.16 63.58,27.88 57.48,27.88
+12V on Top Layer: 21.53,26.08 26.75,26.08 26.75,23.35 21.53,23.35
+12V on Top Layer: 33.45,41.69 37.8,41.69 37.8,32.47 33.45,32.47
+12V on Top Layer: 21.53,17.07 26.75,17.07 26.75,14.34 21.53,14.34
+12V on Top Layer: 41.62,16.39 46.97,16.39 46.97,10.29 41.62,10.29
+12V on Inner2: 20.59,36.55 60.24,36.55 60.24,10.38 20.59,10.38
GND on Top Layer: -2.72,58.72 88.47,58.72 88.47,-4.53 -2.72,-4.53
GND on Top Layer: -2.72,56.43 88.47,56.43 88.47,-6.82 -2.72,-6.82
GND on Bottom Layer: -2.72,57.45 88.47,57.45 88.47,-5.8 -2.72,-5.8
GND on Inner1: -2.72,56.81 88.47,56.81 88.47,-6.44 -2.72,-6.44
GND on Inner2: -2.46,56.17 88.72,56.17 88.72,-7.07 -2.46,-7.07
GND_IN on Top Layer: 38.42,13.89 56.47,13.89 56.47,1.31 38.42,1.31
VS on Top Layer: 61.55,43.22 63.49,43.22 63.49,40.68 61.55,40.68
$1N4920 on Top Layer: 17.22,45.51 24.97,45.51 24.97,40.55 17.22,40.55
$1N14596 on Top Layer: 41.1,40.43 46.18,40.43 46.18,33.82 41.1,33.82
$1N59627 on Top Layer: 40.19,28.06 41.46,28.06 41.46,27.17 40.19,27.17
$2N538 on Top Layer: 59.9,21.63 64.85,21.63 64.85,19.6 59.9,19.6
$2N1605 on Top Layer: 18.62,22.58 28.02,22.58 28.02,20.42 18.62,20.42
$2N1618 on Top Layer: 18.49,31.54 27.89,31.54 27.89,29.38 18.49,29.38
$2N3428 on Top Layer: 64.68,40 67.91,40 67.91,36.59 64.68,36.59
$2N3430 on Top Layer: 60.15,35.6 64.59,35.6 64.59,33.57 60.15,33.57
$2N4466 on Top Layer: 60.15,48.56 64.72,48.56 64.72,46.52 60.15,46.52
$2N40244 on Top Layer: 69.68,40.17 72.62,40.17 72.62,38.05 69.68,38.05

Small or netless copper shapes (teardrops, artwork), in the pictures only: 2 on Top Layer

## Text on the board
Bottom Silkscreen Layer: https://oshwlab.com/pololamag/nafa-astralim | 1-W | GND | 3.3V | SCL | SDA | PWM / +12V | JLCJLCJLCJLC | Vs | 12V | v1.0 | DC IN | DC / OUT
Top Silkscreen Layer: https://oshwlab.com/ / pololamag/nafa-astralim | OUT3 / [Vs] | OUT2 / [12V] | OUT1 / [12V] | PWM0 / [12V] | PWM1 / [12V] | GPS / VCC | GPS / PPS | GPS / RXD | GPS / TXD | GPS / GND | [mA] | 9V/5V | Disable Vt | GND | [12V] | [Vs] | RPi | v1.0 | 12V | Vt | Vs | 1-Wire | DC 12V IN | I2C OUT | 5V
